# Altium schematic sheet logic_trainer_ascii_seed.SchDoc
size 127 x 101 mm
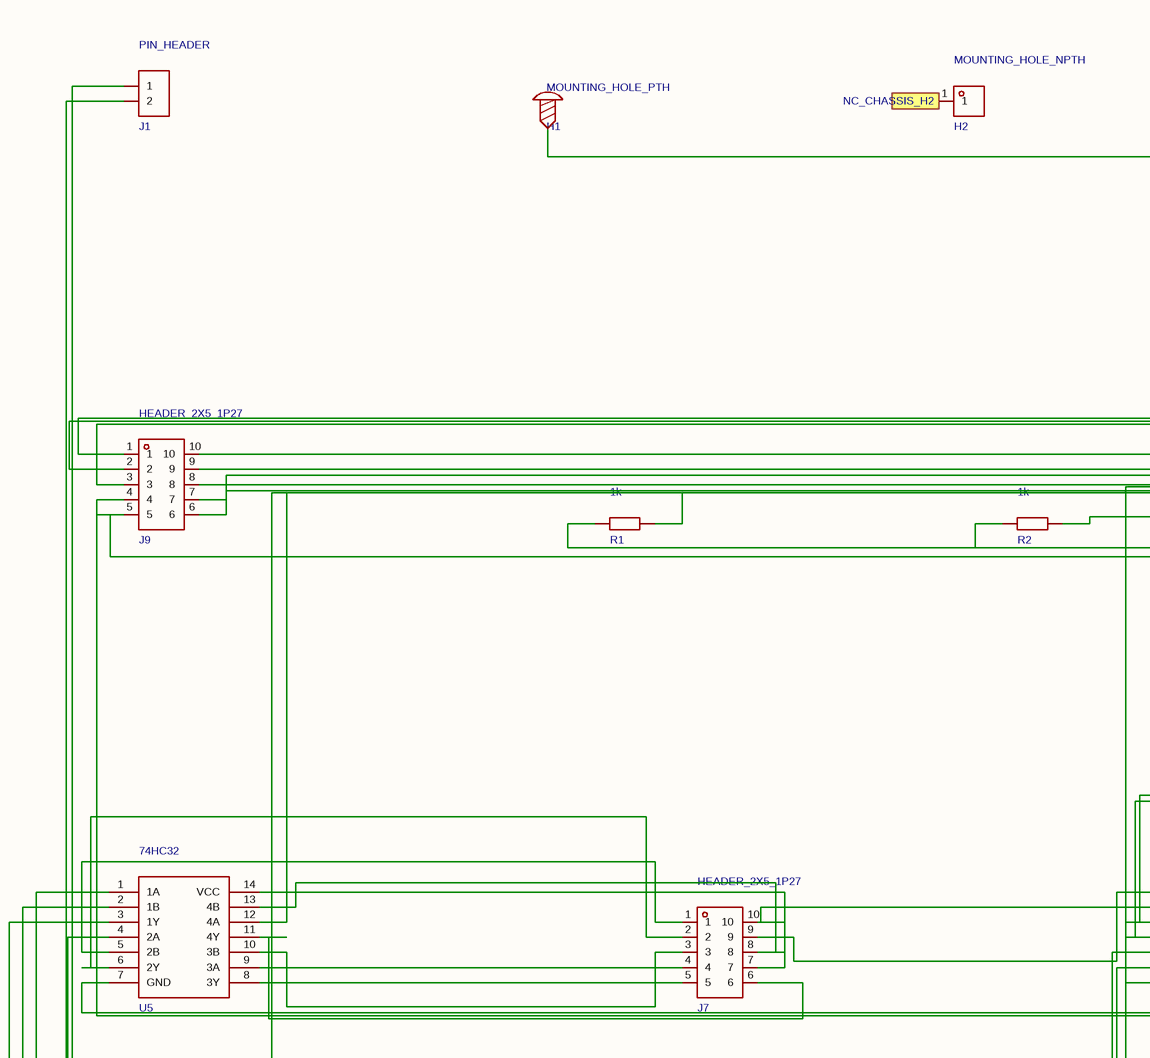
[diagram p0: logic_trainer_ascii_seed.SchDoc, top left]
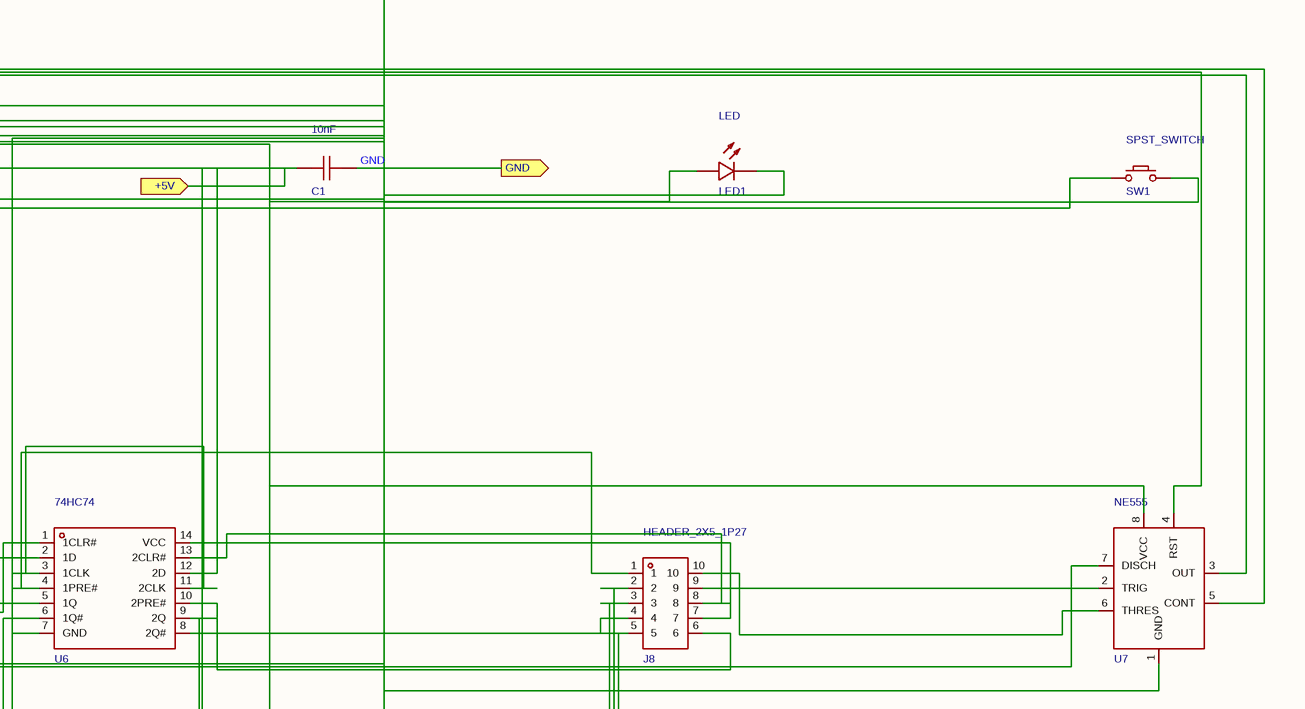
[diagram p1: logic_trainer_ascii_seed.SchDoc, top right]
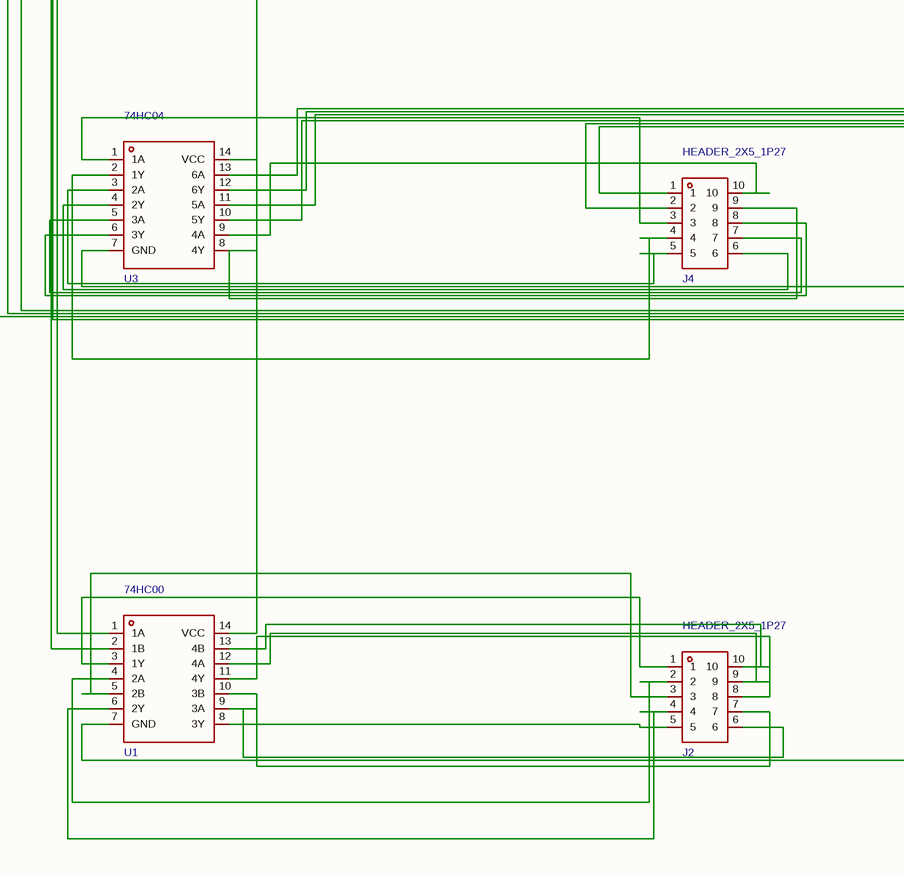
[diagram p2: logic_trainer_ascii_seed.SchDoc, bottom left]
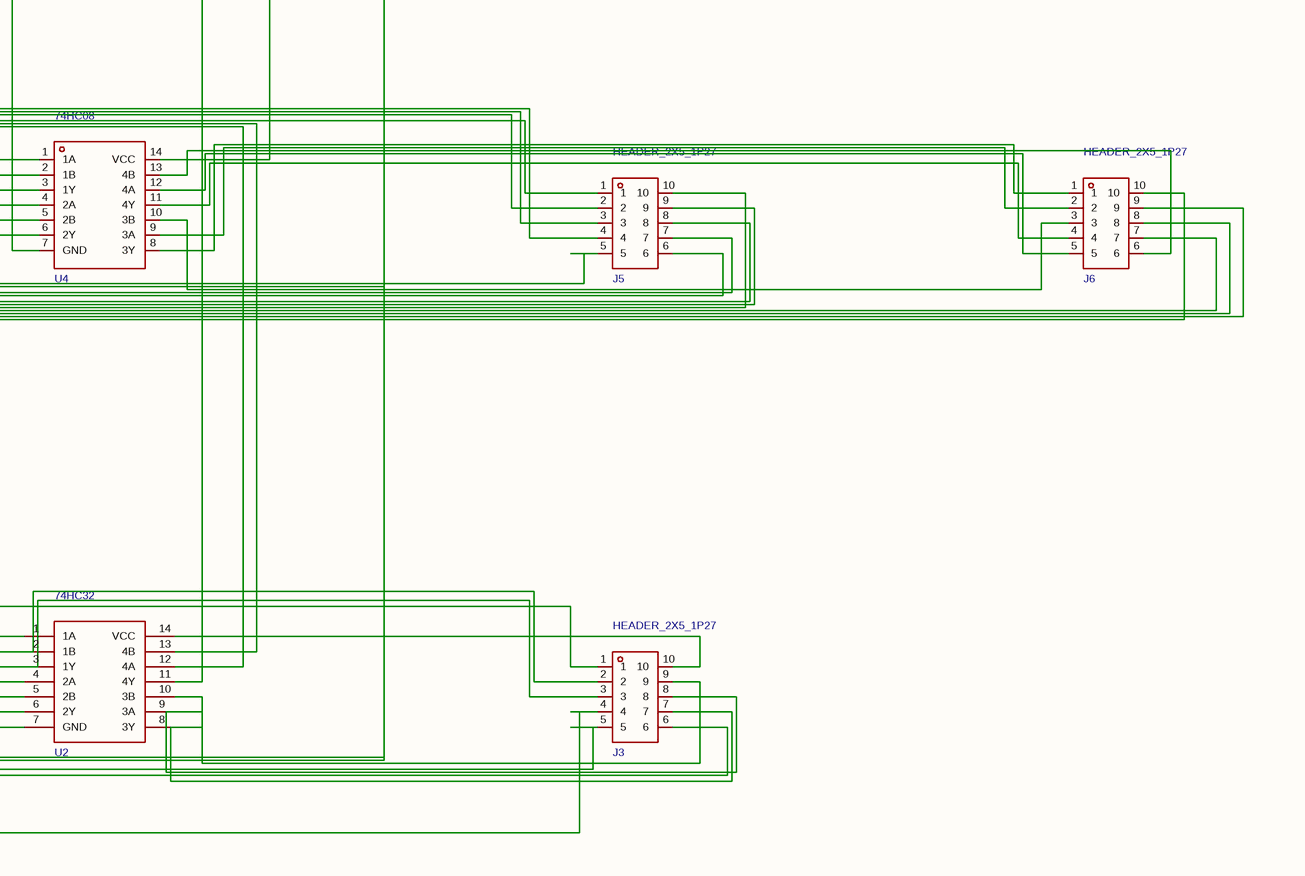
[diagram p3: logic_trainer_ascii_seed.SchDoc, bottom right]

## Parts
C1  value 10nF  [C1812]
H1  value MOUNTING_HOLE_PTH  [Screw-Hole-M3]
H2  value MOUNTING_HOLE_NPTH  [SMD-1_BD5.5-D4.0]
J1  value PIN_HEADER  [HDR-TH_2P-P2.54-V-F]
J2  value HEADER_2X5_1P27  [HDR-TH_10P-P1.27-V-M-R2-C5-S1.27_C9900014843]
J3  value HEADER_2X5_1P27  [HDR-TH_10P-P1.27-V-M-R2-C5-S1.27_C9900014843]
J4  value HEADER_2X5_1P27  [HDR-TH_10P-P1.27-V-M-R2-C5-S1.27_C9900014843]
J5  value HEADER_2X5_1P27  [HDR-TH_10P-P1.27-V-M-R2-C5-S1.27_C9900014843]
J6  value HEADER_2X5_1P27  [HDR-TH_10P-P1.27-V-M-R2-C5-S1.27_C9900014843]
J7  value HEADER_2X5_1P27  [HDR-TH_10P-P1.27-V-M-R2-C5-S1.27_C9900014843]
J8  value HEADER_2X5_1P27  [HDR-TH_10P-P1.27-V-M-R2-C5-S1.27_C9900014843]
J9  value HEADER_2X5_1P27  [HDR-TH_10P-P1.27-V-M-R2-C5-S1.27_C9900014843]
LED1  value LED  [LED-TH_BD3.8-P2.54-FD]
R1  value 1k  [RES-TH_BD2.4-L6.3-P10.30-D0.6]
R2  value 1k  [RES-TH_BD2.4-L6.3-P10.30-D0.6]
SW1  value SPST_SWITCH  [Key_TH_3.5x6x4.3]
U1  value 74HC00  [DIP-14_L20.0-W7.6-P2.54-LS7.6-BL]
U2  value 74HC32  [SOIC-14_L8.7-W3.9-P1.27-LS6.0-BL]
U3  value 74HC04  [DIP-14_L19.2-W6.6-P2.54-LS10.9-BL]
U4  value 74HC08  [DIP-14_L19.2-W6.6-P2.54-LS10.9-BL]
U5  value 74HC32  [SOIC-14_L8.7-W3.9-P1.27-LS6.0-BL]
U6  value 74HC74  [PDIP-14_L19.3-W6.4-P2.54-LS7.6-BL]
U7  value NE555  [SOIC-8_L4.9-W3.9-P1.27-LS6.0-BL]

## Ports
+5V (in), GND (out), NC_CHASSIS_H2 (in)

## Nets
GND: C1.1 C1.2 H1.1 J3.10 J4.1 J4.2 J4.3 J4.9 J4.10 J5.1 J5.2 J5.3 J5.4 J5.5 J5.6 J5.7 J5.8 J5.9 J5.10 J6.6 J6.7 J6.8 J6.9 J6.10 J7.1 J7.7 J7.8 J7.9 J7.10 J8.1 J8.2 J8.3 J8.7 J8.8 J8.9 J8.10 J9.4 J9.5 J9.6 J9.7 J9.8 J9.9 J9.10 LED1.1(A) LED1.2(C) R1.1 R1.2 R2.1 R2.2 SW1.A SW1.B U1.7(GND) U1.14(VCC) U2.7(GND) U2.11(4Y) U2.12(4A) U2.13(4B) U2.14(VCC) U3.1(1A) U3.7(GND) U3.8(4Y) U3.9(4A) U3.10(5Y) U3.11(5A) U3.12(6Y) U3.13(6A) U3.14(VCC) U4.1(1A) U4.2(1B) U4.3(1Y) U4.4(2A) U4.5(2B) U4.6(2Y) U4.7(GND) U4.13(4B) U4.14(VCC) U5.1(1A) U5.2(1B) U5.3(1Y) U5.4(2A) U5.5(2B) U5.7(GND) U5.12(4A) U5.13(4B) U5.14(VCC) U6.1(1CLR#) U6.2(1D) U6.3(1CLK) U6.4(1PRE#) U6.5(1Q) U6.6(1Q#) U6.7(GND) U6.11(2CLK) U6.12(2D) U6.13(2CLR#) U6.14(VCC) U7.1(GND) U7.2(TRIG) U7.6(THRES) U7.7(DISCH) U7.8(VCC) ; port +5V, port GND
NC_CHASSIS_H2: H2.1 ; port NC_CHASSIS_H2
NetJ1_1: J1.1 J1.2 J2.1 U1.1(1A) U1.2(1B) U1.3(1Y)
NetJ2_2: J2.2 U1.4(2A)
NetJ2_3: J2.3 U1.5(2B)
NetJ2_4: J2.4 U1.6(2Y)
NetJ2_5: J2.5 J2.6 J2.7 U1.8(3Y) U1.9(3A) U1.10(3B)
NetJ2_8: J2.8 J2.9 J2.10 U1.11(4Y) U1.12(4A) U1.13(4B)
NetJ3_1: J3.1 U2.1(1A)
NetJ3_2: J3.2 U2.2(1B)
NetJ3_3: J3.3 U2.3(1Y)
NetJ3_4: J3.4 U2.4(2A)
NetJ3_5: J3.5 U2.5(2B)
NetJ3_6: J3.6 J3.7 J3.8 J3.9 U2.6(2Y) U2.8(3Y) U2.9(3A) U2.10(3B)
NetJ4_4: J4.4 U3.2(1Y)
NetJ4_5: J4.5 U3.3(2A)
NetJ4_6: J4.6 U3.4(2Y)
NetJ4_7: J4.7 U3.5(3A)
NetJ4_8: J4.8 U3.6(3Y)
NetJ6_1: J6.1 J6.2 J6.3 J6.4 J6.5 U4.8(3Y) U4.9(3A) U4.10(3B) U4.11(4Y) U4.12(4A)
NetJ7_2: J7.2 U5.6(2Y)
NetJ7_3: J7.3 J7.4 J7.5 U5.8(3Y) U5.9(3A) U5.10(3B)
NetJ7_6: J7.6 U5.11(4Y)
NetJ8_4: J8.4 J8.5 J8.6 U6.8(2Q#) U6.9(2Q) U6.10(2PRE#)
NetJ9_1: J9.1 J9.2 J9.3 U7.3(OUT) U7.4(RST) U7.5(CONT)

## Library data of the parts
C1 = FN43N104J500EGG: Capacitance: Tolerance:±5% Tolerance:±5% Voltage Rated: Temperature Coefficient:; Manufacturer: PSA(信昌电陶); 3D Model Transform: 177.2,126,0,0,0,0,0,0,0; Add into BOM: yes; Tolerance: ±5%; ModelId: 654205cbd64044c4b833fe7af5979bc9; ModelName: C1812_L4.5-W3.2-H2.6; Convert to PCB: yes; Datasheet: https://atta.szlcsc.com/upload/public/pdf/source/20190124/C363570_F638A9872F507A24CA2AD74B49411221.pdf; JLCPCB Part Class: Extended Part; LCSC Part Name: 100nF ±5% 50V; Manufacturer Part: FN43N104J500EGG; Supplier: LCSC; Supplier Footprint: 1812; Supplier Part: C363570; Device: FN43N104J500EGG; Symbol: FN43N104J500EGG; FootprintName: C1812
H1 = Screw-Hole-M3: Add into BOM: yes; Convert to PCB: yes; Supplier Footprint: 插件; Device: Screw-Hole-M3; FootprintName: Screw-Hole-M3; SymbolName: Screw-Hole
H2 = NPTH_4.4: 3D Model Transform: 216.535,216.508,0,0,0,0,-0.001,0.001,-59.055; Add into BOM: yes; ModelId: 92dd3d33edd44f7b9097c6e7d7205abb; Convert to PCB: yes; JLCPCB Part Class: Extended Part; LCSC Part Name: NPTH_4.4; Manufacturer Part: NPTH_4.4; Supplier: LCSC; Supplier Footprint: -; Supplier Part: C9900034891; Device: NPTH_4.4; Symbol: NPTH_4.4; ModelName: SMD-1_BD5.5-D4.0; FootprintName: SMD-1_BD5.5-D4.0
J1 = 2.54-1*2P母: Pitch:2.54mm Number of Holes:2 Number of Rows:1 Holes Structure:1x2P Row Spacing:- Mounting Type:Straight Insulation Height:- Contact Material:- Contact Plating:-; Manufacturer: BOOMELE(博穆精密); 3D Model Transform: 215.7,98.4,0,0,0,0,0,0,-129.9; Add into BOM: yes; Connector Type: 排母; Holes Structure: 1x2P; Number of Holes: 2; Pitch: 2.54mm; Symbol: Header-Female-2.54_1x2; ModelId: a9450ef445564560a104363b9aacde4e; ModelName: HDR-TH_2P-P2.54-F-LI-1X2P; Contact Finish - Mating: -; Contact Material: -; Contact Plating: -; Convert to PCB: yes; Current Rating: -; Datasheet: https://atta.szlcsc.com/upload/public/pdf/source/20151109/1457707570988.pdf; Insulation Height: -; JLCPCB On Sale: 1; JLCPCB Part Class: Extended Part; LCSC On Sale: 1; LCSC Part Name: 2.54mm 1x2P; Manufacturer Part: 2.54-1*2P母; Mounting Type: Straight; Number of Pins: 2; Number of Rows: 1; Overall Length: -; Row Spacing: -; Supplier: LCSC; Supplier Footprint: 直插,P=2.54mm; Supplier Part: C49661; Tail Length - Post: -; Type: 直插; Withstand Voltage: -; Device: 2.54-1*2P母; FootprintName: HDR-TH_2P-P2.54-V-F
J2-J9 = 1.27_2x5_3.6THR: 3D Model Transform: 242.1255,118.11,0,0,0,0,0,0,-78.74; Add into BOM: yes; ModelId: 74a7add9349f47acbcc36fece2436624; Convert to PCB: yes; JLCPCB Part Class: Extended Part; LCSC Part Name: 1.27_2x5_3.6THR; Manufacturer Part: 1.27_2x5_3.6THR; Supplier: LCSC; Supplier Footprint: 1.27mm_2x5; Supplier Part: C9900014843; Device: 1.27_2x5_3.6THR; Symbol: 1.27_2X5_3.6THR; ModelName: HDR-TH_10P-P1.27-V-M-R2-C5-S1.27_C9900014843; FootprintName: HDR-TH_10P-P1.27-V-M-R2-C5-S1.27_C9900014843
LED1 = 204-10SDRD/S530-A3-L: Emitted Color:红灯; Manufacturer: EVERLIGHT(台湾亿光); 3D Model Transform: 139.516,157.15173,0,0,0,0,-9.054,-1.181,-137.795; Add into BOM: yes; Emitted Color: 红灯; ModelId: 7a5158147ccf41a18926a05cf5a7749d; Convert to PCB: yes; Datasheet: https://atta.szlcsc.com/upload/public/pdf/source/20170717/C84774_1500286941158822251.pdf; JLCPCB Part Class: Extended Part; LCSC Part Name: 红灯; Manufacturer Part: 204-10SDRD/S530-A3-L; Supplier: LCSC; Supplier Footprint: 插件; Supplier Part: C84774; Device: 204-10SDRD/S530-A3-L; Symbol: 204-10SDRD/S530-A3-L; ModelName: LED-TH_BD3.8-P2.54-FD; FootprintName: LED-TH_BD3.8-P2.54-FD
R1 R2 = MFR-25JT-52-10K: Type:Metal Film Resistors Resistance: Tolerance:±5% Tolerance:±5%; Manufacturer: YAGEO(国巨); 3D Model Transform: 427.165,94.32816,0,0,0,0,0,0,-196.85; Add into BOM: yes; Tolerance: ±5%; ModelId: 463263665006444ab7a47bd11b0cf956; Convert to PCB: yes; Datasheet: https://atta.szlcsc.com/upload/public/pdf/source/20180412/C176451_538BAA8CAA6C4E34B2E0B3A089A2720C.pdf; JLCPCB Part Class: Extended Part; LCSC Part Name: 10kΩ ±5%; Manufacturer Part: MFR-25JT-52-10K; Supplier: LCSC; Supplier Footprint: 轴向引线; Supplier Part: C176451; Type: Metal Film Resistors; Device: MFR-25JT-52-10K; Symbol: MFR-25JT-52-10K; ModelName: RES-TH_BD2.4-L6.3-P10.30-D0.6; FootprintName: RES-TH_BD2.4-L6.3-P10.30-D0.6
SW1 = Key_TH_3.5x6x4.3: 3D Model Transform: 308.49,137.8,335.08,0,0,0,0,0,-129.92; Add into BOM: yes; ModelId: c3523f9014d949d7ba5445190a3178990819f05c4eef4c71ace90d822a990e87; ModelName: SW-TH_L6.0-W3.5-H5.0-P6.5; Convert to PCB: yes; Supplier Footprint: 插件; Device: Key_TH_3.5x6x4.3; FootprintName: Key_TH_3.5x6x4.3; SymbolName: Key_TH_3.5x6x4.3
U1 = SN74HC00N: Series: Logic Type:与Non-门 Number of Circuits/Elements: Number of Inputs/Bits per Element: Supply Voltage（Single）: Quiescent Current (Max):2μA Current - Output High, Low:5.2mA、5.2mA Operating Temperature: Max Propagation Delay @ V, Max CL:; Manufacturer: TI(德州仪器); 3D Model Transform: 787.4,311.8,0,0,0,0,0,0,-137.8; Add into BOM: yes; Logic Type: 与Non-门; Quiescent Current (Max): 2μA; ModelId: 35a471f8b2b5419fa7599e1770a65989; ModelName: DIP-14_L20.0-W6.7-H4.1-LS7.62-P2.54; Convert to PCB: yes; Current - Output High, Low: 5.2mA、5.2mA; Datasheet: https://atta.szlcsc.com/upload/public/pdf/source/20140711/1457707146135.pdf; JLCPCB Part Class: Extended Part; LCSC Part Name: SN74HC00N; Manufacturer Part: SN74HC00N; Supplier: LCSC; Supplier Footprint: DIP-14; Supplier Part: C2902; Device: SN74HC00N; Symbol: SN74HC00N; FootprintName: DIP-14_L20.0-W7.6-P2.54-LS7.6-BL
U2 U5 = 74HC32D,653: Manufacturer: Nexperia(安世); 3D Model Transform: 338.583,236.22,0,0,0,0,0,-0.001,0; Add into BOM: yes; ModelId: 8dbf5b715d42428c85558507ae5a252b; ModelName: SOIC-14_L8.6-W3.9-H1.8-LS6.0-P1.27; Convert to PCB: yes; Datasheet: https://atta.szlcsc.com/upload/public/pdf/source/20120402/1457706456034.pdf; JLCPCB Part Class: Extended Part; LCSC Part Name: 74HC32D,653; Manufacturer Part: 74HC32D,653; Supplier: LCSC; Supplier Footprint: SOIC-14_150mil; Supplier Part: C5632; Device: 74HC32D,653; Symbol: 74HC32D,653; FootprintName: SOIC-14_L8.7-W3.9-P1.27-LS6.0-BL
U3 = SN74HC04N: Manufacturer: TI(德州仪器); 3D Model Transform: 787.4,311.8,0,0,0,0,0,0,-118.1; Add into BOM: yes; ModelId: 35a471f8b2b5419fa7599e1770a65989; ModelName: DIP-14_L20.0-W6.7-H4.1-LS7.62-P2.54; Convert to PCB: yes; Datasheet: https://atta.szlcsc.com/upload/public/pdf/source/20140226/1457706993311.pdf; JLCPCB Part Class: Extended Part; LCSC Part Name: SN74HC04N; Manufacturer Part: SN74HC04N; Supplier: LCSC; Supplier Footprint: DIP-14; Supplier Part: C2886; Device: SN74HC04N; Symbol: SN74HC04N; FootprintName: DIP-14_L19.2-W6.6-P2.54-LS10.9-BL
U4 = SN74HC08N: Series: Logic Type:And Number of Circuits/Elements: Number of Inputs/Bits per Element: Supply Voltage（Single）: Quiescent Current (Max):2μA Current - Output High, Low:5.2mA、5.2mA Operating Temperature: Max Propagation Delay @ V, Max CL:; Manufacturer: TI(德州仪器); 3D Model Transform: 787.4,311.8,0,0,0,0,0,0,-118.1; Add into BOM: yes; Logic Type: And; Quiescent Current (Max): 2μA; ModelId: 35a471f8b2b5419fa7599e1770a65989; ModelName: DIP-14_L20.0-W6.7-H4.1-LS7.62-P2.54; Convert to PCB: yes; Current - Output High, Low: 5.2mA、5.2mA; Datasheet: https://atta.szlcsc.com/upload/public/pdf/source/20140226/1457706993360.pdf; JLCPCB Part Class: Extended Part; LCSC Part Name: SN74HC08N; Manufacturer Part: SN74HC08N; Supplier: LCSC; Supplier Footprint: DIP-14; Supplier Part: C2887; Device: SN74HC08N; Symbol: SN74HC08N; FootprintName: DIP-14_L19.2-W6.6-P2.54-LS10.9-BL
U6 = SN74HC74N: Series: Function:Set,Reset Type: Number of Elements:2 Number of Bits per Element:1; Manufacturer: TI(德州仪器); 3D Model Transform: 755.9,339.4,0,0,0,0,0,0,-118.1; Add into BOM: yes; Number of Bits per Element: 1; Number of Elements: 2; ModelId: 0e4e817b8ab14b26b2080b9dcc0889a2; ModelName: PDIP-14_L19.2-W6.4-H5.1-P2.54-LS8.0-BL; Convert to PCB: yes; Datasheet: https://atta.szlcsc.com/upload/public/pdf/source/20140711/1457707146090.pdf; Function: Set,Reset; JLCPCB Part Class: Extended Part; LCSC Part Name: SN74HC74N; Manufacturer Part: SN74HC74N; Supplier: LCSC; Supplier Footprint: DIP-14; Supplier Part: C2895; Device: SN74HC74N; Symbol: SN74HC74N; FootprintName: PDIP-14_L19.3-W6.4-P2.54-LS7.6-BL
U7 = NE555DR: Type:555 Type，计时器/振荡器(单路) Count:- Frequency:100kHz Supply Voltage:4.5V~16V Supply Voltage:4.5V~16V Supply Current:10mA Operating Temperature:0℃~+70℃ Operating Temperature:0℃~+70℃; Manufacturer: TI(德州仪器); 3D Model Transform: 189.751,236.22,0,0,0,0,0.0005,0.0005,0; Add into BOM: yes; Supply Current: 10mA; ModelId: e81d2f7d937b4a6ab1dca543ff5d56a4; ModelName: SOIC-8_L4.9-W3.9-H1.7-LS6.0-P1.27; Convert to PCB: yes; Count: -; Datasheet: https://atta.szlcsc.com/upload/public/pdf/source/20140704/1457707116116.pdf; JLCPCB Part Class: Basic Part; LCSC Part Name: NE555DR; Manufacturer Part: NE555DR; Operating Temperature: 0℃~+70℃; Supplier: LCSC; Supplier Footprint: SOIC-8_150mil; Supplier Part: C7593; Supply Voltage: 4.5V~16V; Type: 555 Type，计时器/振荡器(单路); Device: NE555DR; Symbol: NE555DR; FootprintName: SOIC-8_L4.9-W3.9-P1.27-LS6.0-BL